# Altium schematic sheet 08_Level_conv_misc.SchDoc: Level converters & Misc
size A3; Organization: Lime Microsystems; Address1: Surrey Tech Centre; Address2: Guildford GU2 7YG; Address3: Surrey; Address4: United Kingdom; Revision: v1.0; SheetNumber: 8; SheetTotal: 11
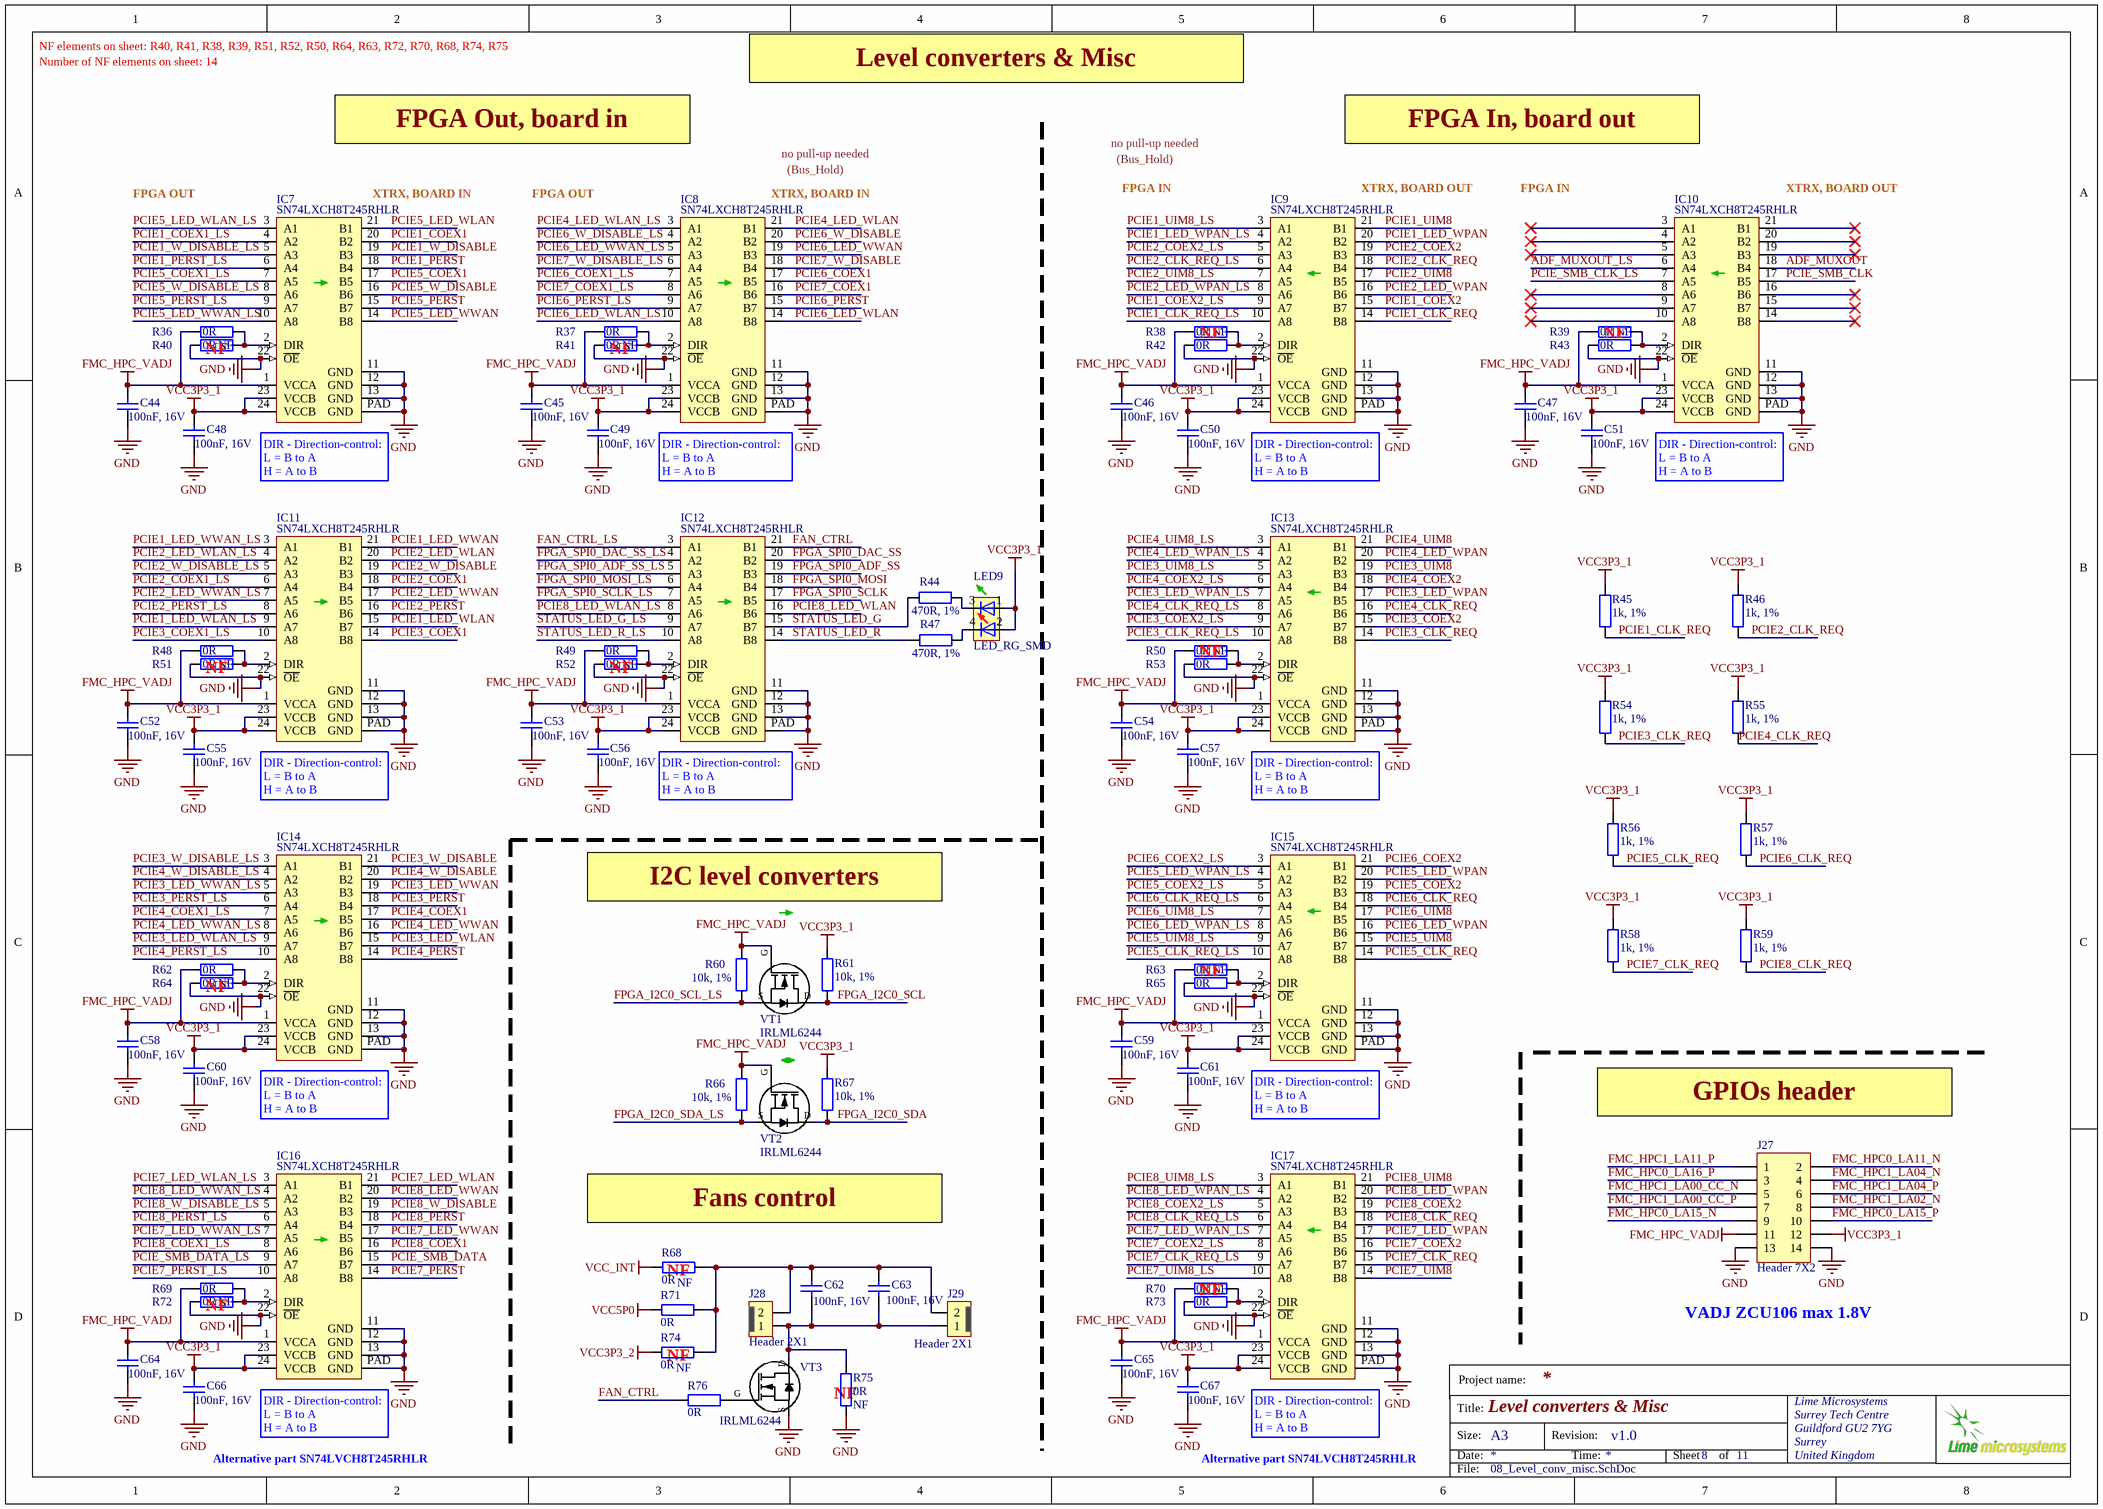
[diagram p0: 08_Level_conv_misc.SchDoc]

## Parts
C44  100nF, 16V  [CAP0402]
C45  100nF, 16V  [CAP0402]
C46  100nF, 16V  [CAP0402]
C47  100nF, 16V  [CAP0402]
C48  100nF, 16V  [CAP0402]
C49  100nF, 16V  [CAP0402]
C50  100nF, 16V  [CAP0402]
C51  100nF, 16V  [CAP0402]
C52  100nF, 16V  [CAP0402]
C53  100nF, 16V  [CAP0402]
C54  100nF, 16V  [CAP0402]
C55  100nF, 16V  [CAP0402]
C56  100nF, 16V  [CAP0402]
C57  100nF, 16V  [CAP0402]
C58  100nF, 16V  [CAP0402]
C59  100nF, 16V  [CAP0402]
C60  100nF, 16V  [CAP0402]
C61  100nF, 16V  [CAP0402]
C62  100nF, 16V  [CAP0402]
C63  100nF, 16V  [CAP0402]
C64  100nF, 16V  [CAP0402]
C65  100nF, 16V  [CAP0402]
C66  100nF, 16V  [CAP0402]
C67  100nF, 16V  [CAP0402]
IC7  SN74LXCH8T245RHLR  [SN74LVC8T245RHLR_24-VQFN_LVL_SHIFTER]
IC8  SN74LXCH8T245RHLR  [SN74LVC8T245RHLR_24-VQFN_LVL_SHIFTER]
IC9  SN74LXCH8T245RHLR  [SN74LVC8T245RHLR_24-VQFN_LVL_SHIFTER]
IC10  SN74LXCH8T245RHLR  [SN74LVC8T245RHLR_24-VQFN_LVL_SHIFTER]
IC11  SN74LXCH8T245RHLR  [SN74LVC8T245RHLR_24-VQFN_LVL_SHIFTER]
IC12  SN74LXCH8T245RHLR  [SN74LVC8T245RHLR_24-VQFN_LVL_SHIFTER]
IC13  SN74LXCH8T245RHLR  [SN74LVC8T245RHLR_24-VQFN_LVL_SHIFTER]
IC14  SN74LXCH8T245RHLR  [SN74LVC8T245RHLR_24-VQFN_LVL_SHIFTER]
IC15  SN74LXCH8T245RHLR  [SN74LVC8T245RHLR_24-VQFN_LVL_SHIFTER]
IC16  SN74LXCH8T245RHLR  [SN74LVC8T245RHLR_24-VQFN_LVL_SHIFTER]
IC17  SN74LXCH8T245RHLR  [SN74LVC8T245RHLR_24-VQFN_LVL_SHIFTER]
J27  Header 7X2  [Header7x2_TH]
J28  Header 2X1  [Header1x2_TH_LOCKING]
J29  Header 2X1  [Header1x2_TH_LOCKING]
LED9  LED_RG_SMD  [LED-2x0603]
R36  0R  [RES0402]
R37  0R  [RES0402]
R38  0R  Assembly Info: NF  [RES0402]
R39  0R  Assembly Info: NF  [RES0402]
R40  0R  Assembly Info: NF  [RES0402]
R41  0R  Assembly Info: NF  [RES0402]
R42  0R  [RES0402]
R43  0R  [RES0402]
R44  470R, 1%  [RES0402]
R45  1k, 1%  [RES0402]
R46  1k, 1%  [RES0402]
R47  470R, 1%  [RES0402]
R48  0R  [RES0402]
R49  0R  [RES0402]
R50  0R  Assembly Info: NF  [RES0402]
R51  0R  Assembly Info: NF  [RES0402]
R52  0R  Assembly Info: NF  [RES0402]
R53  0R  [RES0402]
R54  1k, 1%  [RES0402]
R55  1k, 1%  [RES0402]
R56  1k, 1%  [RES0402]
R57  1k, 1%  [RES0402]
R58  1k, 1%  [RES0402]
R59  1k, 1%  [RES0402]
R60  10k, 1%  [RES0402]
R61  10k, 1%  [RES0402]
R62  0R  [RES0402]
R63  0R  Assembly Info: NF  [RES0402]
R64  0R  Assembly Info: NF  [RES0402]
R65  0R  [RES0402]
R66  10k, 1%  [RES0402]
R67  10k, 1%  [RES0402]
R68  0R  Assembly Info: NF  [RES0402]
R69  0R  [RES0402]
R70  0R  Assembly Info: NF  [RES0402]
R71  0R  [RES0402]
R72  0R  Assembly Info: NF  [RES0402]
R73  0R  [RES0402]
R74  0R  Assembly Info: NF  [RES0402]
R75  0R  Assembly Info: NF  [RES0402]
R76  0R  [RES0402]
VT1  IRLML6244  [SOT23-3]
VT2  IRLML6244  [SOT23-3]
VT3  IRLML6244  [SOT23-3]

## Nets
FMC_HPC_VADJ: C44.2 C45.2 C46.2 C47.2 C52.2 C53.2 C54.2 C58.2 C59.2 C64.2 C65.2 IC7.1(VCCA) IC8.1(VCCA) IC9.1(VCCA) IC10.1(VCCA) IC11.1(VCCA) IC12.1(VCCA) IC13.1(VCCA) IC14.1(VCCA) IC15.1(VCCA) IC16.1(VCCA) IC17.1(VCCA) J27.11 R36.1 R37.1 R38.1 R39.1 R48.1 R49.1 R50.1 R60.1 R62.1 R63.1 R66.1 R69.1 R70.1 VT1.G VT2.G
GND: C44.1 C45.1 C46.1 C47.1 C48.1 C49.1 C50.1 C51.1 C52.1 C53.1 C54.1 C55.1 C56.1 C57.1 C58.1 C59.1 C60.1 C61.1 C64.1 C65.1 C66.1 C67.1 IC7.11(GND) IC7.12(GND) IC7.13(GND) IC7.22(~{OE}) IC7.PAD(GND) IC8.11(GND) IC8.12(GND) IC8.13(GND) IC8.22(~{OE}) IC8.PAD(GND) IC9.11(GND) IC9.12(GND) IC9.13(GND) IC9.22(~{OE}) IC9.PAD(GND) IC10.11(GND) IC10.12(GND) IC10.13(GND) IC10.22(~{OE}) IC10.PAD(GND) IC11.11(GND) IC11.12(GND) IC11.13(GND) IC11.22(~{OE}) IC11.PAD(GND) IC12.11(GND) IC12.12(GND) IC12.13(GND) IC12.22(~{OE}) IC12.PAD(GND) IC13.11(GND) IC13.12(GND) IC13.13(GND) IC13.22(~{OE}) IC13.PAD(GND) IC14.11(GND) IC14.12(GND) IC14.13(GND) IC14.22(~{OE}) IC14.PAD(GND) IC15.11(GND) IC15.12(GND) IC15.13(GND) IC15.22(~{OE}) IC15.PAD(GND) IC16.11(GND) IC16.12(GND) IC16.13(GND) IC16.22(~{OE}) IC16.PAD(GND) IC17.11(GND) IC17.12(GND) IC17.13(GND) IC17.22(~{OE}) IC17.PAD(GND) J27.13 J27.14 R40.1 R41.1 R42.1 R43.1 R51.1 R52.1 R53.1 R64.1 R65.1 R72.1 R73.1 R75.1 VT3.S
VCC3P3_1: C48.2 C49.2 C50.2 C51.2 C55.2 C56.2 C57.2 C60.2 C61.2 C66.2 C67.2 IC7.23(VCCB) IC7.24(VCCB) IC8.23(VCCB) IC8.24(VCCB) IC9.23(VCCB) IC9.24(VCCB) IC10.23(VCCB) IC10.24(VCCB) IC11.23(VCCB) IC11.24(VCCB) IC12.23(VCCB) IC12.24(VCCB) IC13.23(VCCB) IC13.24(VCCB) IC14.23(VCCB) IC14.24(VCCB) IC15.23(VCCB) IC15.24(VCCB) IC16.23(VCCB) IC16.24(VCCB) IC17.23(VCCB) IC17.24(VCCB) J27.12 LED9.1 LED9.2 R45.2 R46.2 R54.2 R55.2 R56.2 R57.2 R58.2 R59.2 R61.1 R67.1
VCC3P3_2: R74.1
VCC5P0: R71.1
VCC_INT: R68.1
ADF_MUXOUT: IC10.18(B4)
ADF_MUXOUT_LS: IC10.6(A4)
FAN_CTRL: IC12.21(B1) R76.1
FAN_CTRL_LS: IC12.3(A1)
FMC_HPC0_LA11_N: J27.2
FMC_HPC0_LA15_N: J27.9
FMC_HPC0_LA15_P: J27.10
FMC_HPC0_LA16_P: J27.3
FMC_HPC1_LA00_CC_N: J27.5
FMC_HPC1_LA00_CC_P: J27.7
FMC_HPC1_LA02_N: J27.8
FMC_HPC1_LA04_N: J27.4
FMC_HPC1_LA04_P: J27.6
FMC_HPC1_LA11_P: J27.1
FPGA_I2C0_SCL: R61.2 VT1.D
FPGA_I2C0_SCL_LS: R60.2 VT1.S
FPGA_I2C0_SDA: R67.2 VT2.D
FPGA_I2C0_SDA_LS: R66.2 VT2.S
FPGA_SPI0_ADF_SS: IC12.19(B3)
FPGA_SPI0_ADF_SS_LS: IC12.5(A3)
FPGA_SPI0_DAC_SS: IC12.20(B2)
FPGA_SPI0_DAC_SS_LS: IC12.4(A2)
FPGA_SPI0_MOSI: IC12.18(B4)
FPGA_SPI0_MOSI_LS: IC12.6(A4)
FPGA_SPI0_SCLK: IC12.17(B5)
FPGA_SPI0_SCLK_LS: IC12.7(A5)
PCIE1_CLK_REQ: IC9.14(B8) R45.1
PCIE1_CLK_REQ_LS: IC9.10(A8)
PCIE1_COEX1: IC7.20(B2)
PCIE1_COEX1_LS: IC7.4(A2)
PCIE1_COEX2: IC9.15(B7)
PCIE1_COEX2_LS: IC9.9(A7)
PCIE1_LED_WLAN: IC11.15(B7)
PCIE1_LED_WLAN_LS: IC11.9(A7)
PCIE1_LED_WPAN: IC9.20(B2)
PCIE1_LED_WPAN_LS: IC9.4(A2)
PCIE1_LED_WWAN: IC11.21(B1)
PCIE1_LED_WWAN_LS: IC11.3(A1)
PCIE1_PERST: IC7.18(B4)
PCIE1_PERST_LS: IC7.6(A4)
PCIE1_UIM8: IC9.21(B1)
PCIE1_UIM8_LS: IC9.3(A1)
PCIE1_W_DISABLE: IC7.19(B3)
PCIE1_W_DISABLE_LS: IC7.5(A3)
PCIE2_CLK_REQ: IC9.18(B4) R46.1
PCIE2_CLK_REQ_LS: IC9.6(A4)
PCIE2_COEX1: IC11.18(B4)
PCIE2_COEX1_LS: IC11.6(A4)
PCIE2_COEX2: IC9.19(B3)
PCIE2_COEX2_LS: IC9.5(A3)
PCIE2_LED_WLAN: IC11.20(B2)
PCIE2_LED_WLAN_LS: IC11.4(A2)
PCIE2_LED_WPAN: IC9.16(B6)
PCIE2_LED_WPAN_LS: IC9.8(A6)
PCIE2_LED_WWAN: IC11.17(B5)
PCIE2_LED_WWAN_LS: IC11.7(A5)
PCIE2_PERST: IC11.16(B6)
PCIE2_PERST_LS: IC11.8(A6)
PCIE2_UIM8: IC9.17(B5)
PCIE2_UIM8_LS: IC9.7(A5)
PCIE2_W_DISABLE: IC11.19(B3)
PCIE2_W_DISABLE_LS: IC11.5(A3)
PCIE3_CLK_REQ: IC13.14(B8) R54.1
PCIE3_CLK_REQ_LS: IC13.10(A8)
PCIE3_COEX1: IC11.14(B8)
PCIE3_COEX1_LS: IC11.10(A8)
PCIE3_COEX2: IC13.15(B7)
PCIE3_COEX2_LS: IC13.9(A7)
PCIE3_LED_WLAN: IC14.15(B7)
PCIE3_LED_WLAN_LS: IC14.9(A7)
PCIE3_LED_WPAN: IC13.17(B5)
PCIE3_LED_WPAN_LS: IC13.7(A5)
PCIE3_LED_WWAN: IC14.19(B3)
PCIE3_LED_WWAN_LS: IC14.5(A3)
PCIE3_PERST: IC14.18(B4)
PCIE3_PERST_LS: IC14.6(A4)
PCIE3_UIM8: IC13.19(B3)
PCIE3_UIM8_LS: IC13.5(A3)
PCIE3_W_DISABLE: IC14.21(B1)
PCIE3_W_DISABLE_LS: IC14.3(A1)
PCIE4_CLK_REQ: IC13.16(B6) R55.1
PCIE4_CLK_REQ_LS: IC13.8(A6)
PCIE4_COEX1: IC14.17(B5)
PCIE4_COEX1_LS: IC14.7(A5)
PCIE4_COEX2: IC13.18(B4)
PCIE4_COEX2_LS: IC13.6(A4)
PCIE4_LED_WLAN: IC8.21(B1)
PCIE4_LED_WLAN_LS: IC8.3(A1)
PCIE4_LED_WPAN: IC13.20(B2)
PCIE4_LED_WPAN_LS: IC13.4(A2)
PCIE4_LED_WWAN: IC14.16(B6)
PCIE4_LED_WWAN_LS: IC14.8(A6)
PCIE4_PERST: IC14.14(B8)
PCIE4_PERST_LS: IC14.10(A8)
PCIE4_UIM8: IC13.21(B1)
PCIE4_UIM8_LS: IC13.3(A1)
PCIE4_W_DISABLE: IC14.20(B2)
PCIE4_W_DISABLE_LS: IC14.4(A2)
PCIE5_CLK_REQ: IC15.14(B8) R56.1
PCIE5_CLK_REQ_LS: IC15.10(A8)
PCIE5_COEX1: IC7.17(B5)
PCIE5_COEX1_LS: IC7.7(A5)
PCIE5_COEX2: IC15.19(B3)
PCIE5_COEX2_LS: IC15.5(A3)
PCIE5_LED_WLAN: IC7.21(B1)
PCIE5_LED_WLAN_LS: IC7.3(A1)
PCIE5_LED_WPAN: IC15.20(B2)
PCIE5_LED_WPAN_LS: IC15.4(A2)
PCIE5_LED_WWAN: IC7.14(B8)
PCIE5_LED_WWAN_LS: IC7.10(A8)
PCIE5_PERST: IC7.15(B7)
PCIE5_PERST_LS: IC7.9(A7)
PCIE5_UIM8: IC15.15(B7)
PCIE5_UIM8_LS: IC15.9(A7)
PCIE5_W_DISABLE: IC7.16(B6)
PCIE5_W_DISABLE_LS: IC7.8(A6)
PCIE6_CLK_REQ: IC15.18(B4) R57.1
PCIE6_CLK_REQ_LS: IC15.6(A4)
PCIE6_COEX1: IC8.17(B5)
PCIE6_COEX1_LS: IC8.7(A5)
PCIE6_COEX2: IC15.21(B1)
PCIE6_COEX2_LS: IC15.3(A1)
PCIE6_LED_WLAN: IC8.14(B8)
PCIE6_LED_WLAN_LS: IC8.10(A8)
PCIE6_LED_WPAN: IC15.16(B6)
PCIE6_LED_WPAN_LS: IC15.8(A6)
PCIE6_LED_WWAN: IC8.19(B3)
PCIE6_LED_WWAN_LS: IC8.5(A3)
PCIE6_PERST: IC8.15(B7)
PCIE6_PERST_LS: IC8.9(A7)
PCIE6_UIM8: IC15.17(B5)
PCIE6_UIM8_LS: IC15.7(A5)
PCIE6_W_DISABLE: IC8.20(B2)
PCIE6_W_DISABLE_LS: IC8.4(A2)
PCIE7_CLK_REQ: IC17.15(B7) R58.1
PCIE7_CLK_REQ_LS: IC17.9(A7)
PCIE7_COEX1: IC8.16(B6)
PCIE7_COEX1_LS: IC8.8(A6)
PCIE7_COEX2: IC17.16(B6)
PCIE7_COEX2_LS: IC17.8(A6)
PCIE7_LED_WLAN: IC16.21(B1)
PCIE7_LED_WLAN_LS: IC16.3(A1)
PCIE7_LED_WPAN: IC17.17(B5)
PCIE7_LED_WPAN_LS: IC17.7(A5)
PCIE7_LED_WWAN: IC16.17(B5)
PCIE7_LED_WWAN_LS: IC16.7(A5)
PCIE7_PERST: IC16.14(B8)
PCIE7_PERST_LS: IC16.10(A8)
PCIE7_UIM8: IC17.14(B8)
PCIE7_UIM8_LS: IC17.10(A8)
PCIE7_W_DISABLE: IC8.18(B4)
PCIE7_W_DISABLE_LS: IC8.6(A4)
PCIE8_CLK_REQ: IC17.18(B4) R59.1
PCIE8_CLK_REQ_LS: IC17.6(A4)
PCIE8_COEX1: IC16.16(B6)
PCIE8_COEX1_LS: IC16.8(A6)
PCIE8_COEX2: IC17.19(B3)
PCIE8_COEX2_LS: IC17.5(A3)
PCIE8_LED_WLAN: IC12.16(B6)
PCIE8_LED_WLAN_LS: IC12.8(A6)
PCIE8_LED_WPAN: IC17.20(B2)
PCIE8_LED_WPAN_LS: IC17.4(A2)
PCIE8_LED_WWAN: IC16.20(B2)
PCIE8_LED_WWAN_LS: IC16.4(A2)
PCIE8_PERST: IC16.18(B4)
PCIE8_PERST_LS: IC16.6(A4)
PCIE8_UIM8: IC17.21(B1)
PCIE8_UIM8_LS: IC17.3(A1)
PCIE8_W_DISABLE: IC16.19(B3)
PCIE8_W_DISABLE_LS: IC16.5(A3)
PCIE_SMB_CLK: IC10.17(B5)
PCIE_SMB_CLK_LS: IC10.7(A5)
PCIE_SMB_DATA: IC16.15(B7)
PCIE_SMB_DATA_LS: IC16.9(A7)
STATUS_LED_G: IC12.15(B7) R44.2
STATUS_LED_G_LS: IC12.9(A7)
STATUS_LED_R: IC12.14(B8) R47.2
STATUS_LED_R_LS: IC12.10(A8)
NetC62_1: C62.1 C63.1 J28.2 J29.2 R68.2 R71.2 R74.2
NetC62_2: C62.2 C63.2 J28.1 J29.1 R75.2 VT3.D
NetIC7_2: IC7.2(DIR) R36.2 R40.2
NetIC8_2: IC8.2(DIR) R37.2 R41.2
NetIC9_2: IC9.2(DIR) R38.2 R42.2
NetIC10_2: IC10.2(DIR) R39.2 R43.2
NetIC11_2: IC11.2(DIR) R48.2 R51.2
NetIC12_2: IC12.2(DIR) R49.2 R52.2
NetIC13_2: IC13.2(DIR) R50.2 R53.2
NetIC14_2: IC14.2(DIR) R62.2 R64.2
NetIC15_2: IC15.2(DIR) R63.2 R65.2
NetIC16_2: IC16.2(DIR) R69.2 R72.2
NetIC17_2: IC17.2(DIR) R70.2 R73.2
NetLED9_3: LED9.3 R44.1
NetLED9_4: LED9.4 R47.1
NetR76_2: R76.2 VT3.G

Not connected (* = marked no-connect by the designer): IC10 3(A1)* 4(A2)* 5(A3)* 8(A6)* 9(A7)* 10(A8)* 14(B8)* 15(B7)* 16(B6)* 19(B3)* 20(B2)* 21(B1)*

## Notes on the sheet
- NF elements on sheet: R40, R41, R38, R39, R51, R52, R50, R64, R63, R72, R70, R68, R74, R75
- Number of NF elements on sheet: 14
- Level converters & Misc
- FPGA Out, board in
- no pull-up needed
- (Bus_Hold)
- FPGA In, board out
- FPGA OUT
- (near IC7) XTRX, BOARD IN
- (near IC8) XTRX, BOARD IN
- FPGA IN
- (near IC9) XTRX, BOARD OUT
- (near IC10) XTRX, BOARD OUT
- (near R40) NF
- (near R41) NF
- NF
- (near IC7) DIR - Direction-control:
  L = B to A
  H = A to B
- (near IC8) DIR - Direction-control:
  L = B to A
  H = A to B
- (near IC9) DIR - Direction-control:
  L = B to A
  H = A to B
- (near IC10) DIR - Direction-control:
  L = B to A
  H = A to B
- (near R51) NF
- (near R52) NF
- (near IC11) DIR - Direction-control:
  L = B to A
  H = A to B
- (near IC12) DIR - Direction-control:
  L = B to A
  H = A to B
- (near IC13) DIR - Direction-control:
  L = B to A
  H = A to B
- I2C level converters
- (near R64) NF
- (near IC14) DIR - Direction-control:
  L = B to A
  H = A to B
- (near IC15) DIR - Direction-control:
  L = B to A
  H = A to B
- (near J27) GPIOs header
- Fans control
- (near R72) NF
- (near R68) NF
- VADJ ZCU106 max 1.8V
- (near R74) NF
- Alternative part SN74LVCH8T245RHLR
- (near IC16) DIR - Direction-control:
  L = B to A
  H = A to B
- (near R75) NF
- (near IC17) DIR - Direction-control:
  L = B to A
  H = A to B
- Project name:
- Title:
- Size:
- Date:
- A3
- Revision:
- Time:
- Sheet
- of
- File:

## Library data of the parts
C44-C61 C64-C67 = Cap_0603: Manufacturer Part Number 1: GRM155R71C104KA88D; Part Description: 0.10µF ±10% 16V X7R Ceramic Capacitor -55°C ~ 125°C Surface Mount, MLCC 0402 (1005 Metric) 0.039" L x 0.020" W (1.00mm x 0.50mm); Brand: Murata Electronics; Tolerance: 10 %; Type: General Purpose MLCC; Capacitance: 0.1 uF; Temperature Coefficient / Code: +/- 15 %; Case Height: 0.5 mm; Case Length: 1 mm; Dielectric: X7R; Supplier 1: Mouser; Supplier Part Number 1: 81-GRM155R71C104KA88; Case Code - in: 0402; Manufacturer: Murata Electronics; Category: Multilayer Ceramic Capacitors MLCC - SMD/SMT; Voltage Rating DC: 16 V; Value: 100nF, 16V; Case Code - mm: 1005; Case Width: 0.5 mm; Maximum Operating Temperature: + 125 C; Minimum Operating Temperature: - 55 C; Minimum Order Quantity: 1; Operating Temperature Range: - 55 C to + 125 C; Package / Case: 0402 (1005 metric); Packaging: Reel; Product: General Type MLCCs; Product Category: Low & Medium Capacitance SMD Ceramic Chip Capacitors; Reeling: True; RoHS - Mouser: Y; RoHS: RoHS Compliant; Series: GRM; Standard Pack Qty: 10000; Termination Style: SMD/SMT
C62 C63 = Cap_0603: Manufacturer Part Number 1: GRM155R71C104KA88D; Part Description: 0.10µF ±10% 16V Ceramic Capacitor X7R 0402 (1005 Metric); Brand: Murata Electronics; Tolerance: 10 %; Type: General Purpose MLCC; Capacitance: 0.1 uF; Temperature Coefficient / Code: +/- 15 %; Case Height: 0.5 mm; Case Length: 1 mm; Dielectric: X7R; Supplier 1: Mouser; Supplier Part Number 1: 81-GRM155R71C104KA88; Case Code - in: 0402; Manufacturer: Murata Electronics; Category: Multilayer Ceramic Capacitors MLCC - SMD/SMT; Voltage Rating DC: 16 V; Value: 100nF, 16V; Manufacturer Part Number: GRM155R71C104KA88D; Case Code - mm: 1005; Case Width: 0.5 mm; Maximum Operating Temperature: + 125 C; Minimum Operating Temperature: - 55 C; Minimum Order Quantity: 1; Operating Temperature Range: - 55 C to + 125 C; Package / Case: 0402 (1005 metric); Packaging: Reel; Product: General Type MLCCs; Product Category: Low & Medium Capacitance SMD Ceramic Chip Capacitors; Reeling: True; RoHS - Mouser: Y; RoHS: RoHS Compliant; Series: GRM; Standard Pack Qty: 10000; Termination Style: SMD/SMT
IC7 = SN74LVC8T245RHLR_LVL_SHIFTER: Part Description: Translation Transceiver 1 Element 8 Bit per Element 3-State Output 24-VQFN (5.5x3.5); Manufacturer: Texas Instruments; Description: 8-bit dual-supply bus transceiver with configurable voltage translation and 3-state outputs 24-VQFN -40 to 125; ComponentLink1URL: https://datasheet.ciiva.com/15086/getdatasheetpartid-241541-15086413.pdf?src-supplier=Verical; ComponentLink1Description: https://datasheet.ciiva.com/15086/getdatasheetpartid-241541-15086413.pdf?src-supplier=Verical; ComponentLink2URL: https://datasheet.ciiva.com/1836/sn74lvch8t245-1836035.pdf?src-supplier=Digi-Key; ComponentLink2Description: https://datasheet.ciiva.com/1836/sn74lvch8t245-1836035.pdf?src-supplier=Digi-Key; ComponentLink3URL: https://datasheet.ciiva.com/1836/sn74lvch8t245-1836034.pdf?src-supplier=Digi-Key; ComponentLink3Description: https://datasheet.ciiva.com/1836/sn74lvch8t245-1836034.pdf?src-supplier=Digi-Key; ComponentLink4URL: https://datasheet.ciiva.com/1836/sn74lvch8t245-1836036.pdf?src-supplier=Digi-Key; ComponentLink4Description: https://datasheet.ciiva.com/1836/sn74lvch8t245-1836036.pdf?src-supplier=Digi-Key; ComponentLink5URL: https://datasheet.ciiva.com/14300/sn74lvch8t245-14300662.pdf?src-supplier=Avnet; ComponentLink5Description: https://datasheet.ciiva.com/14300/sn74lvch8t245-14300662.pdf?src-supplier=Avnet; Supplier 1: Digi-Key; Supplier Part Number 1: 296-SN74LXCH8T245RHLRCT-ND; Manufacturer Part Number 1: SN74LXCH8T245RHLR; Stock 1: 2724; Pricing 1: 1=2,1, 10=1,883, 25=1,7768, 100=1,5138, 250=1,4214, 500=1,24372, 1000=1,03052 (USD); RoHS: No
IC8-IC17 = SN74LVC8T245RHLR_LVL_SHIFTER: Part Description: Translation Transceiver 1 Element 8 Bit per Element 3-State Output 24-VQFN (5.5x3.5); Manufacturer: Texas Instruments; ComponentLink1Description: https://datasheet.ciiva.com/15086/getdatasheetpartid-241541-15086413.pdf?src-supplier=Verical; ComponentLink1URL: https://datasheet.ciiva.com/15086/getdatasheetpartid-241541-15086413.pdf?src-supplier=Verical; ComponentLink2Description: https://datasheet.ciiva.com/1836/sn74lvch8t245-1836035.pdf?src-supplier=Digi-Key; ComponentLink2URL: https://datasheet.ciiva.com/1836/sn74lvch8t245-1836035.pdf?src-supplier=Digi-Key; ComponentLink3Description: https://datasheet.ciiva.com/1836/sn74lvch8t245-1836034.pdf?src-supplier=Digi-Key; ComponentLink3URL: https://datasheet.ciiva.com/1836/sn74lvch8t245-1836034.pdf?src-supplier=Digi-Key; ComponentLink4Description: https://datasheet.ciiva.com/1836/sn74lvch8t245-1836036.pdf?src-supplier=Digi-Key; ComponentLink4URL: https://datasheet.ciiva.com/1836/sn74lvch8t245-1836036.pdf?src-supplier=Digi-Key; ComponentLink5Description: https://datasheet.ciiva.com/14300/sn74lvch8t245-14300662.pdf?src-supplier=Avnet; ComponentLink5URL: https://datasheet.ciiva.com/14300/sn74lvch8t245-14300662.pdf?src-supplier=Avnet; Manufacturer Part Number 1: SN74LXCH8T245RHLR; Pricing 1: 1=2,1, 10=1,883, 25=1,7768, 100=1,5138, 250=1,4214, 500=1,24372, 1000=1,03052 (USD); RoHS: No; Stock 1: 2724; Supplier 1: Digi-Key; Supplier Part Number 1: 296-SN74LXCH8T245RHLRCT-ND
J27 = Header 7X2: Header, 7-Pin, Dual row; Manufacturer 1: Adam Equipment; Manufacturer Part Number: PH2-14-UA; Part Description: Connector Header Through Hole 14 position 0.100" (2.54mm); Number of Positions: 14; Pitch: 2.54mm; Supplier 1: Digi-Key; Supplier Part Number 1: 2057-PH2-14-UA-ND; Stock 1: 11861; Pricing 1: 1=0,24000, 10=0,19900, 100=0,15340, 500=0,12976, 1000=0,10617, 5000=0,09437, 10000=0,08553 (USD); RoHS: Yes; Termination: Solder; Lead Free: Lead Free; ComponentLink1URL: https://datasheet.ciiva.com/16397/ph2-14-ua-16397187.pdf?src-supplier=Future+Electronics; ComponentLink1Description: https://datasheet.ciiva.com/16397/ph2-14-ua-16397187.pdf?src-supplier=Future+Electronics; Manufacturer: Adam Equipment; Manufacturer Part Number 1: PH2-14-UA
J28 J29 = Header 2X1 LOCK: Manufacturer 1: Molex; Part Description: Connector Header Through Hole 2 position 0.100" (2.54mm); Supplier 1: Digi-Key; Supplier Part Number 1: WM19460-ND; Manufacturer Part Number: 22-11-2026; Stock 1: 0; RoHS: Yes; ComponentLink1URL: https://datasheet.ciiva.com/5156/022045042-sd-206842-5156139.pdf?src-supplier=Mouser; ComponentLink1Description: https://datasheet.ciiva.com/5156/022045042-sd-206842-5156139.pdf?src-supplier=Mouser; ComponentLink2URL: https://datasheet.ciiva.com/30212/022232051-sd-30212109.pdf?src-supplier=Onlinecomponents.com; ComponentLink2Description: https://datasheet.ciiva.com/30212/022232051-sd-30212109.pdf?src-supplier=Onlinecomponents.com; Manufacturer: Molex; Manufacturer Part Number 1: 22-11-2026
LED9 = LED_green_red_SMD: Manufacturer Part Number 1: HSMF-C165; Manufacturer: Avago Technologies US Inc.; Part Description: LED GREEN/RED DIFFUSED 0603 SMD; Millicandela Rating: 15mcd Green, 10mcd Red; Lens Transparency: Diffused; Lens Color: White; Lens Style/Size: Rectangle with Flat Top, 1.60mm x 0.80mm; Wavelength - Peak: 570nm Green, 636nm Red; Wavelength - Dominant: 572nm Green, 621nm Red; Viewing Angle: 120°; Voltage - Forward (Vf) (Typ): 2.2V Green, 1.95V Red; Current - Test: 20mA; Color: Green, Red; Supplier 1: Digi-Key; Height (Max): 0.50mm; Packaging: Cut Tape (CT); Category: Optoelectronics; Mounting Type: Surface Mount; Package / Case: 0603 (1608 Metric); Size / Dimension: 1.60mm L x 0.80mm W; Supplier Device Package: *; RoHS: RoHS Compliant; Supplier Part Number 1: 516-1419-1-ND
R36-R43 R48-R53 R62-R65 R68-R76 = Res_0402: Manufacturer Part Number 1: RC0402JR-070RL; Manufacturer: Yageo; Part Description: RES SMD 0.0OHM JUMPER 1/16W 0402; Resistance (Ohms): 0.0; Tolerance: Jumper; Power (Watts): 0.063W, 1/16W; Value: 0R; Supplier 1: Digi-Key; Supplier Part Number 1: 311-0.0JRTR-ND; Category: Resistors; Temperature Coefficient: -; Features: Moisture Resistant; Supplier Device Package: 0402; Height: 0.016" (0.40mm); Package / Case: 0402 (1005 Metric); Operating Temperature: -55°C ~ 155°C; Size / Dimension: 0.039" L x 0.020" W (1.00mm x 0.50mm); Composition: Thick Film; Packaging: Tape & Reel (TR); Number of Terminations: 2; RoHS: RoHS Compliant
R44 R47 = Res_0402: Manufacturer 1: Yageo; Manufacturer Part Number 1: RC0402FR-07470RL; Part Description: 470 Ohms ±1% 0.063W, 1/16W Chip Resistor 0402 (1005 Metric) Moisture Resistant Thick Film; Power Rating: 62.5mW; Temperature Coefficient: 100ppm/°C; Voltage Rating: 50V; Max Power Dissipation: 63mW; Value: 470R, 1%; Supplier 1: Digi-Key; Supplier Part Number 1: 311-470LRCT-ND; Stock 1: 1652476; Pricing 1: 1=0,10000, 10=0,01600, 100=0,00660, 1000=0,00299, 2500=0,00259, 5000=0,00214 (USD); RoHS: Yes; Case/Package: 0402; Case Code (Metric): 1005; Case Code (Imperial): 0402; Size Code: 0402; Min Operating Temperature: -55°C; Max Operating Temperature: 155°C; Packaging: Tape and Reel; Tolerance: 1%; Resistance: 470R; Number of Terminations: 2; Features: Moisture Resistant; Package Quantity: 1; Resistor Type: Thick Film; Termination: SMD/SMT; Series: RC; Resistance Tolerance: 1%; Construction: Rectangular; Length: 1mm; Width: 0.02inch; Height: 0.016inch; Depth: 0.5mm; Lead Free: Lead Free; REACH SVHC: Unknown; Military Standard: Not; RoHS Compliant: Yes; Manufacturer: Yageo
R45 R46 R54-R59 = Res_0402: Manufacturer: Stackpole Electronics Inc; Manufacturer Part Number 1: RMCF0402FT1K00; Part Description: RES SMD 1K OHM 1% 1/16W 0402; Temperature Coefficient: ±100ppm/°C; Power (Watts): 0.063W, 1/16W; Value: 1k, 1%; Supplier 1: Digi-Key; Supplier Part Number 1: RMCF0402FT1K00TR-ND; Resistance (Ohms): 1k; Packaging: Tape & Reel (TR); Category: Resistors; RoHS: RoHS Compliant; Tolerance: ±1%; Height: 0.016" (0.40mm); Number of Terminations: 2; Package / Case: 0402 (1005 Metric); Operating Temperature: -55°C ~ 155°C; Features: -; Composition: Thick Film; Supplier Device Package: 0402; Size / Dimension: 0.039" L x 0.020" W (1.00mm x 0.50mm)
R60 R61 R66 R67 = Res_0402: Manufacturer: Yageo; Manufacturer Part Number 1: RC0402FR-0710KL; Part Description: RES SMD 10K OHM 1% 1/16W 0402; Temperature Coefficient: ±100ppm/°C; Power (Watts): 0.063W, 1/16W; Value: 10k, 1%; Supplier 1: Digi-Key; Supplier Part Number 1: 311-10.0KLRTR-ND; Resistance (Ohms): 10k; Packaging: Tape & Reel (TR); RoHS: RoHS Compliant; Package / Case: 0402 (1005 Metric); Tolerance: ±1%; Operating Temperature: -55°C ~ 155°C; Size / Dimension: 0.039" L x 0.020" W (1.00mm x 0.50mm); Number of Terminations: 2; Category: Resistors; Height: 0.016" (0.40mm); Supplier Device Package: 0402; Features: Moisture Resistant; Composition: Thick Film
VT1-VT3 = NDS331N: Manufacturer: Infineon Technologies; Manufacturer Part Number 1: IRLML6244TRPBF; Part Description: N-Channel 20V 6.3A (Ta) 1.3W (Ta) Surface Mount Micro3™/SOT-23; FET Type: N-Channel; Current - Continuous Drain (Id) @ 25°C: 6.3A (Ta); Drive Voltage (Max Rds On,  Min Rds On): 2.5V, 4.5V; Vgs(th) (Max) @ Id: 1.1V @ 10µA; Gate Charge (Qg) (Max) @ Vgs: 8.9nC @ 4.5V; Input Capacitance (Ciss) (Max) @ Vds: 700pF @ 16V; Vgs (Max): ±12V; Power Dissipation (Max): 1.3W (Ta); Rds On (Max) @ Id, Vgs: 21 mOhm @ 6.3A, 4.5V; Supplier 1: Digi-Key; Supplier Part Number 1: IRLML6244TRPBFTR-ND; RoHS: RoHS Compliant; Category: Discrete Semiconductor Products; Stock 1: 21000; Pricing 1: 3000=0.09979 (USD); Packaging: Tape & Reel (TR); Part Status: Active; Technology: MOSFET (Metal Oxide); FET Feature: -; Operating Temperature: -55°C ~ 150°C (TJ); Mounting Type: Surface Mount; Supplier Device Package: Micro3™/SOT-23; Package / Case: TO-236-3, SC-59, SOT-23-3; ComponentLink1URL: https://www.infineon.com/dgdl/irlml6244pbf.pdf?fileId=5546d462533600a4015356686fed261f; ComponentLink1Description: https://www.infineon.com/dgdl/irlml6244pbf.pdf?fileId=5546d462533600a4015356686fed261f